# EasyEDA Pro project main_board_2025-10-18.epro

# Board PCB1
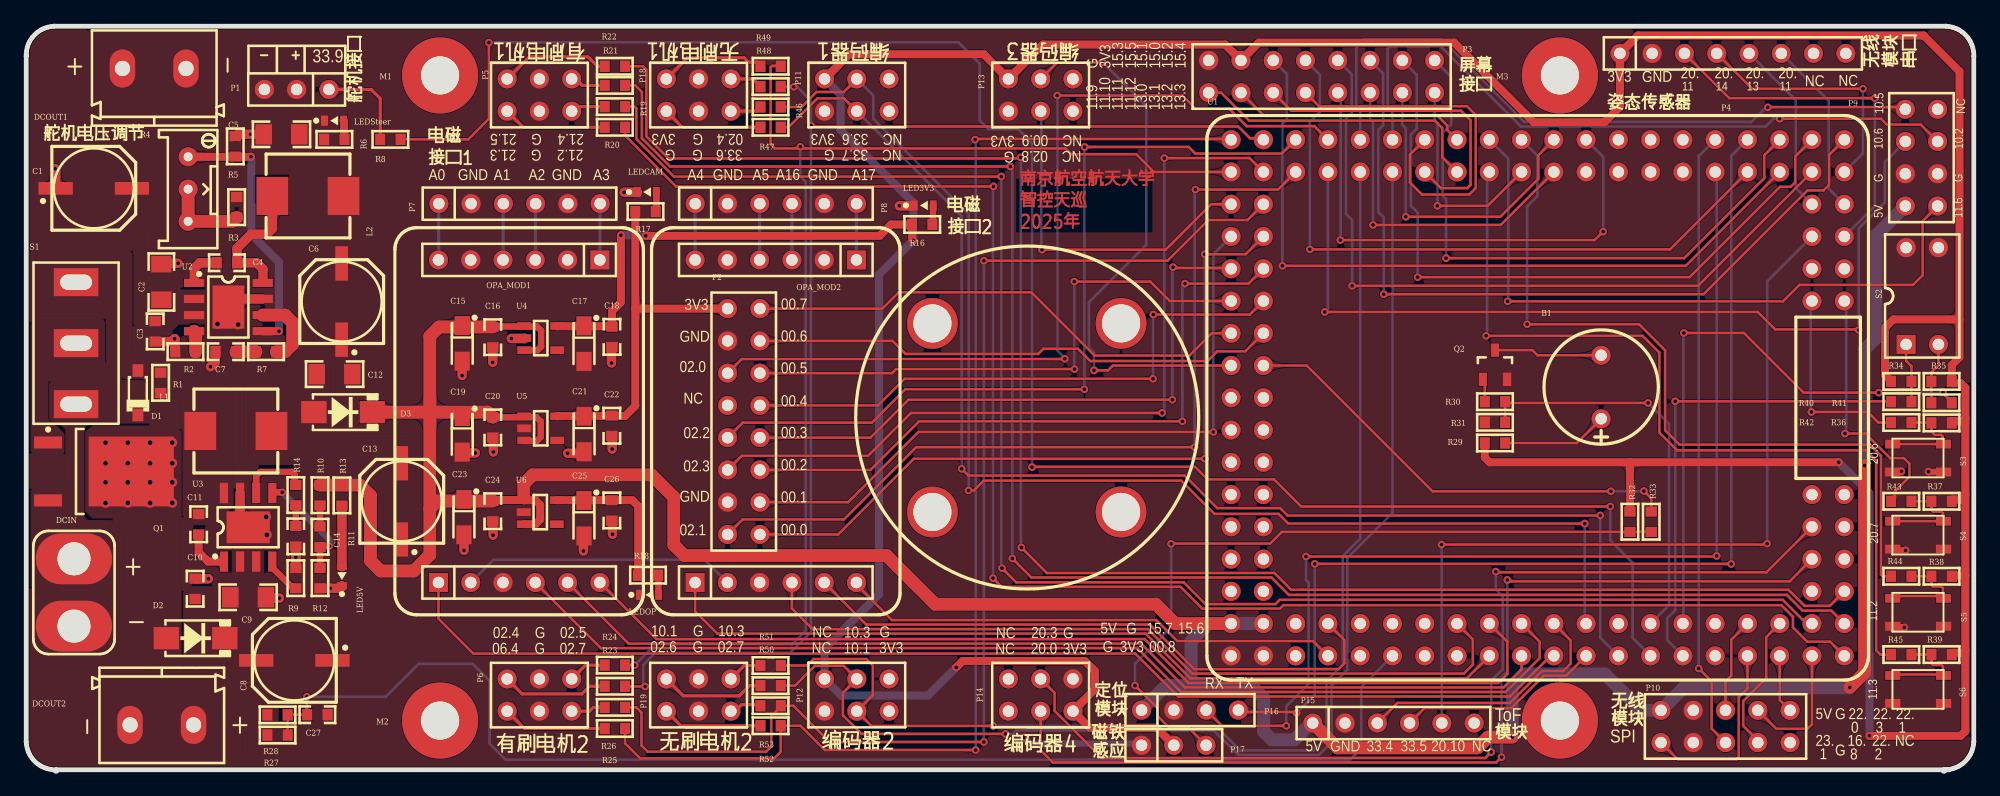
[diagram p0: board, top side]
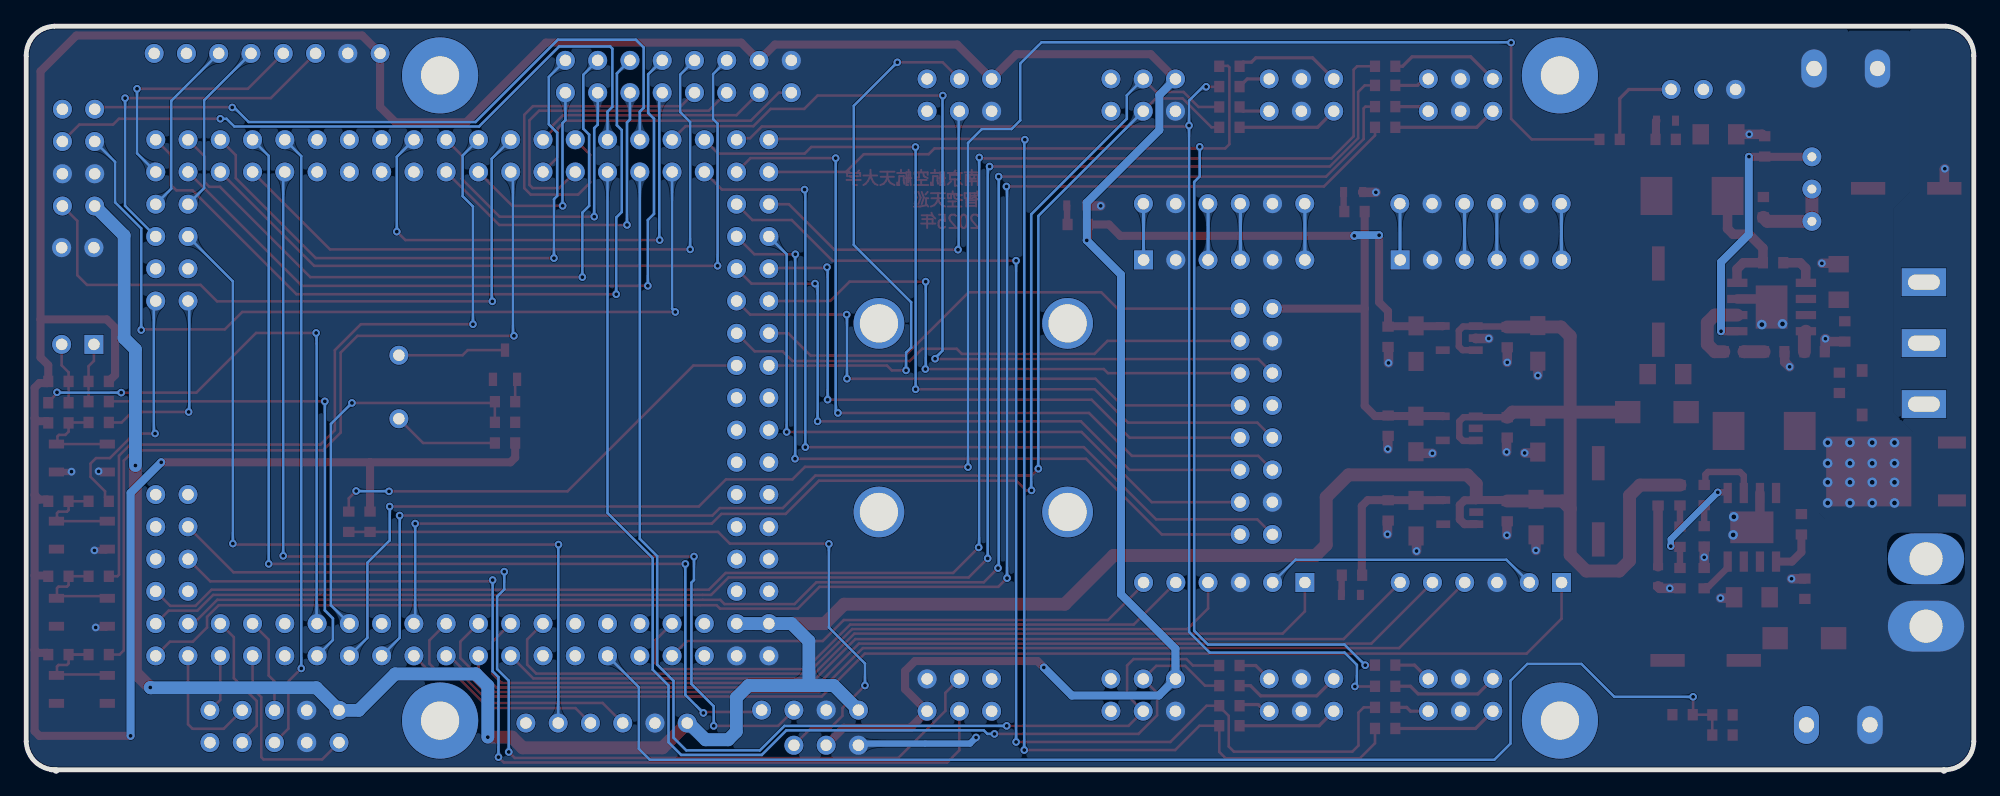
[diagram p1: board, bottom side, seen from below]

Outline 153.42 x 58.68 mm; copper layers: Top Layer, Bottom Layer. Coordinates in mm from the lower left corner of the outline.
Outline path: 0,56.26 0.13,56.26 arc(0.73,57.85) 2.29,58.55 151.13,58.55 arc(152.68,57.85) 153.29,56.26 153.29,2.29 arc(152.59,0.73) 151,0.13 ; 0,56.26 arc(0.64,57.94) 2.28,58.68 arc(2.28,58.68) 2.29,58.68 151.13,58.68 arc(151.13,58.68) 151.13,58.68 arc(152.75,57.96) 153.42,56.33 arc(153.42,56.29) 153.42,56.26 153.42,2.29 arc(153.42,2.29) 153.42,2.28 arc(152.84,0.81) 151.47,0.03 arc(151.43,0.01) 151.38,0 151.13,0 arc(151.07,0) 151,0 2.42,0 arc(0.73,0.64) 0,2.28 arc(0,2.3) 0,2.31 0,56.24 arc(0,56.25) 0,56.26 ; 0.13,56.39 0.13,2.29 arc(0.82,0.73) 2.41,0.13 151.38,0.13
Stack: Top Layer 0.0356mm / Dielectric 1 0.32mm FR-4 er 4.8 / Bottom Layer 0.0356mm

## Design rules (mm)
via RoutingVias (default): diameter min 0.61, default 1.27, max 1.27; hole min 0.305, default 0.711, max 0.711

## Placement (name value [footprint] x y rotation side)
B1  BEEP  [BEEP 9x5.5mm]  124.02 30.2 90 top
C1  100uF 35V 铝电解  [CAP-E-S 6.3]  5.38 45.85 180 top
C2  4.7uF 35V X5R  [CAPC3216[1206]S]  10.7 38.47 270 top
C3  100nF 50V X7R  [CAPC1608[0603]S-N]  10.22 34.58 90 top
C4  100nF 50V X7R  [CAPC1608[0603]S-N]  15.86 39.99 180 top
C5  47uF 25V X5R  [CAPC3216[1206]S]  20.16 50.1 0 top
C6  220uF 25V 铝电解  [CAP-E-S 6.3]  24.89 36.93 270 top
C7  4.7nF 50V X7R  [CAPC1608[0603]S-N]  15.77 32.98 0 top
C8  100uF 35V 铝电解  [CAP-E-S 6.3]  21.17 8.68 0 top
C9  4.7uF 35V X5R  [CAPC3216[1206]S]  17.53 13.65 180 top
C10  100nF 50V X7R  [CAPC1608[0603]S-N]  13.36 14.32 270 top
C11  100nF 50V X7R  [CAPC1608[0603]S-N]  13.63 19.39 270 top
C12  47uF 25V X5R  [CAPC3216[1206]S]  24.33 31.22 180 top
C13  220uF 25V 铝电解  [CAP-E-S 6.3]  29.62 21.2 270 top
C14  4.7nF 50V X7R  [CAPC1608[0603]S-N]  21.28 18.45 90 top
C15  10uF 16V 钽电容  [CAP-T-S 3216]  34.38 33.64 270 top
C16  100nF 50V X7R  [CAPC1608[0603]S-N]  36.79 34.13 90 top
C17  10uF 16V 钽电容  [CAP-T-S 3216]  43.96 33.62 270 top
C18  100nF 50V X7R  [CAPC1608[0603]S-N]  46.17 34.16 90 top
C19  10uF 16V 钽电容  [CAP-T-S 3216]  34.38 26.48 270 top
C20  100nF 50V X7R  [CAPC1608[0603]S-N]  36.79 27.02 90 top
C21  10uF 16V 钽电容  [CAP-T-S 3216]  43.97 26.51 270 top
C22  100nF 50V X7R  [CAPC1608[0603]S-N]  46.16 27.16 90 top
C23  10uF 16V 钽电容  [CAP-T-S 3216]  34.52 19.96 270 top
C24  100nF 50V X7R  [CAPC1608[0603]S-N]  36.79 20.43 90 top
C25  10uF 16V 钽电容  [CAP-T-S 3216]  43.96 19.87 270 top
C26  100nF 50V X7R  [CAPC1608[0603]S-N]  46.16 20.49 90 top
C27  100nF 50V X7R  [CAPC1608[0603]S-N]  22.98 4.4 0 top
D1  BZT52C16  [SOD-123-L]  8.85 29.75 270 top
D2  SS54  [SMA-L[DO-214AC]]  13.4 10.42 0 top
D3  SS54  [SMA-L[DO-214AC]]  25.01 28.23 0 top
DCIN  T型插头  [Wired T-Header ThroughHole]  3.82 14.02 0 top
DCOUT1  KF/WJ/DG 30x connecter  [KF/WJ/DG 301-2p-5.0mm]  10.14 55.28 180 top
DCOUT2  KF/WJ/DG 30x connecter  [KF/WJ/DG 301-2p-5.0mm]  10.73 3.6 0 top
L1  4.7uH 5A  [0630 TPC 7*7*3]  16.56 26.74 0 top
L2  4.7uH 5A  [0630 TPC 7*7*3]  22.24 45.25 0 top
LED3V3  翠绿贴片LED  [LEDC1608(0603)-L]  70.71 44.5 0 top
LED5V  翠绿贴片LED  [LEDC1608(0603)-L]  24.91 15.3 90 top
LEDCAM  翠绿贴片LED  [LEDC1608(0603)-L]  48.91 45.55 0 top
LEDOP  翠绿贴片LED  [LEDC1608(0603)-L]  49.09 13.84 0 top
LEDSteer  翠绿贴片LED  [LEDC1608(0603)-L]  24.29 51.17 0 top
M1  MountHole  [M3-MountHole-Plated-D6#3]  32.64 54.74 0 top
M2  MountHole  [M3-MountHole-Plated-D6#3]  32.64 3.94 0 top
M3  MountHole  [M3-MountHole-Plated-D6#3]  120.78 54.74 0 top
M4  MountHole  [M3-MountHole-Plated-D6#3]  120.78 3.94 0 top
M5  MountHole  [M3-MountHole-Plated-D6]  92.04 41.02 135 top
M6  MountHole  [M3-MountHole-Plated-D6#5]  92.7 24.3 135 top
M7  MountHole  [M3-MountHole-Plated-D6#2]  83.14 16.54 135 top
M8  MountHole  [M3-MountHole-Plated-D6#4]  77.88 13.87 135 top
OPA_MOD1  OPA_MOD  [SEEKFREE_4CHANEL_OPAMOD]  38.86 27.51 0 top
OPA_MOD2  OPA_MOD  [SEEKFREE_4CHANEL_OPAMOD]  59.06 27.51 0 top
P1  Header-D-M 1x3P  [HDR1X3-M]  23.89 53.63 180 top
P2  Header-D-F 2x8P  [HDR2X8-F]  57.81 18.59 90 top
P3  Header-D-F 2x8P  [HDR2X8-F]  93.14 53.38 0 top
P4  Header-D-M 1x8P  [HDR1X8-M]  125.5 56.47 0 top
P5  Header-D-M 2x3P  [HDR2X3-M]  43 54.46 180 top
P6  Header-D-M 2x3P  [HDR2X3-M]  37.92 4.68 0 top
P7  Header-D-M 1x6P  [HDR1X6-M]  32.54 44.64 0 top
P8  Header-D-M 1x6P  [HDR1X6-M]  52.72 44.64 0 top
P9  Header-D-F 2x4P  [HDR2X4-F]  147.97 52.07 270 top
P10  Header-D-F 2x5P  [HDR2X5-F]  138.9 4.75 180 top
P11  Header-D-M 2x3P  [HDR2X3-M]  67.98 54.46 180 top
P12  Header-D-M 2x3P  [HDR2X3-M]  67.98 7.22 180 top
P13  Header-D-M 2x3P  [HDR2X3-M]  82.45 54.46 180 top
P14  Header-D-M 2x3P  [HDR2X3-M]  77.37 4.68 0 top
P15  Header-D-M 1x6P  [HDR1X6-M]  101.33 3.74 0 top
P16  Header-D-M 1x4P  [HDR1X4-M]  87.85 4.76 0 top
P17  Header-D-M 1x3P  [HDR1X3-M]  87.85 2 0 top
P18  Header-D-M 2x3P  [HDR2X3-M]  55.52 54.46 180 top
P19  Header-D-M 2x3P  [HDR2X3-M]  50.44 4.68 0 top
Q1  HY19P03  [TO-252AA]  5.06 23.55 0 top
Q2  S8050  [SOT-23]  115.67 31.96 90 top
R1  10K ±1%  [RESC1608[0603]S-N]  10.64 30.53 90 top
R2  200K ±1%  [RESC1608[0603]S-N]  12.6 32.98 0 top
R3  27K ±1%  [RESC1608[0603]S-N]  16.63 44.36 90 top
R4  50K  [RESPOT3296W]  12.81 45.79 270 top
R5  8.2K ±1%  [RESC1608[0603]S-N]  16.52 49.15 270 top
R6  10K ±1%  [RESC1608[0603]S-N]  24.32 49.7 180 top
R7  20K ±1%  [RESC1608[0603]S-N]  18.94 32.98 0 top
R8  100R ±1%  [RESC1608[0603]S-N]  28.73 49.7 180 top
R9  200K ±1%  [RESC1608[0603]S-N]  21.28 15.15 270 top
R10  27K ±1%  [RESC1608[0603]S-N]  23.19 21.68 90 top
R11  1.5K ±1%  [RESC1608[0603]S-N]  23.19 18.42 90 top
R12  8.2K ±1%  [RESC1608[0603]S-N]  23.19 15.15 90 top
R13  10K ±1%  [RESC1608[0603]S-N]  24.91 21.67 90 top
R14  20K ±1%  [RESC1608[0603]S-N]  21.28 21.7 90 top
R16  2.7K ±1%  [RESC1608[0603]S-N]  70.59 43 0 top
R17  2.7K ±1%  [RESC1608[0603]S-N]  48.81 44.02 0 top
R18  2.7K ±1%  [RESC1608[0603]S-N]  49 15.39 0 top
R19  100R ±1%  [RESC1608[0603]S-N]  46.39 52.28 180 top
R20  100R ±1%  [RESC1608[0603]S-N]  46.39 50.65 0 top
R21  100R ±1%  [RESC1608[0603]S-N]  46.39 53.95 180 top
R22  100R ±1%  [RESC1608[0603]S-N]  46.39 55.46 0 top
R23  100R ±1%  [RESC1608[0603]S-N]  46.39 6.64 180 top
R24  100R ±1%  [RESC1608[0603]S-N]  46.39 8.31 0 top
R25  100R ±1%  [RESC1608[0603]S-N]  46.39 3.32 180 top
R26  100R ±1%  [RESC1608[0603]S-N]  46.39 4.98 0 top
R27  200K ±1%  [RESC1608[0603]S-N]  19.84 4.39 0 top
R28  20K ±1%  [RESC1608[0603]S-N]  19.84 2.8 180 top
R29  10R ±1%  [RESC1608[0603]S-N]  115.67 25.8 0 top
R30  4.7K ±1%  [RESC1608[0603]S-N]  115.67 29.05 180 top
R31  1K ±1%  [RESC1608[0603]S-N]  115.67 27.42 180 top
R32  10K ±1%  [RESC1608[0603]S-N]  126.29 19.59 90 top
R33  100R ±1%  [RESC1608[0603]S-N]  127.97 19.59 270 top
R34  4.7K ±1%  [RESC1608[0603]S-N]  147.65 30.64 0 top
R35  4.7K ±1%  [RESC1608[0603]S-N]  150.82 30.64 180 top
R36  4.7K ±1%  [RESC1608[0603]S-N]  150.82 27.38 180 top
R37  4.7K ±1%  [RESC1608[0603]S-N]  150.82 21.21 180 top
R38  4.7K ±1%  [RESC1608[0603]S-N]  150.82 15.3 180 top
R39  4.7K ±1%  [RESC1608[0603]S-N]  150.82 9.14 180 top
R40  470R ±1%  [RESC1608[0603]S-N]  147.65 29.05 180 top
R41  470R ±1%  [RESC1608[0603]S-N]  150.82 28.96 0 top
R42  470R ±1%  [RESC1608[0603]S-N]  147.65 27.41 180 top
R43  470R ±1%  [RESC1608[0603]S-N]  147.65 21.21 180 top
R44  470R ±1%  [RESC1608[0603]S-N]  147.65 15.3 180 top
R45  470R ±1%  [RESC1608[0603]S-N]  147.65 9.14 180 top
R46  100R ±1%  [RESC1608[0603]S-N]  58.65 52.25 180 top
R47  100R ±1%  [RESC1608[0603]S-N]  58.65 50.65 0 top
R48  100R ±1%  [RESC1608[0603]S-N]  58.65 53.86 180 top
R49  100R ±1%  [RESC1608[0603]S-N]  58.65 55.46 0 top
R50  100R ±1%  [RESC1608[0603]S-N]  58.65 6.69 180 top
R51  100R ±1%  [RESC1608[0603]S-N]  58.65 8.27 0 top
R52  100R ±1%  [RESC1608[0603]S-N]  58.65 3.53 180 top
R53  100R ±1%  [RESC1608[0603]S-N]  58.65 5.11 0 top
S1  SW-SPDT  [SS12D10]  3.99 33.66 90 top
S2  SW DIP-2  [Code SW-2-DIP-2.54]  149.3 37.37 0 top
S3  Button  [PTS810-3*4-CurvePin]  148.98 24.61 0 top
S4  Button  [PTS810-3*4-CurvePin]  148.98 18.54 0 top
S5  Button  [PTS810-3*4-CurvePin]  148.98 12.47 0 top
S6  Button  [PTS810-3*4-CurvePin]  148.98 6.39 0 top
U1  -  [TC264_CoreBoard]  94.9 9.03 90 top
U2  SP1N28STER  [SOP-8E]  15.98 36.5 0 top
U3  SP1N28STER  [SOP-8E]  17.53 19.16 90 top
U4  RT9013-33  [SOT-23-5]  40.56 34.06 0 top
U5  RT9013-33  [SOT-23-5]  40.56 26.95 0 top
U6  RT9013-33  [SOT-23-5]  40.52 20.35 0 top

## Footprints (pads in the part's own frame, mm; a bottom-side part is the same pattern mirrored in y, then rotated)
0630 TPC 7*7*3
  rect 2.5x3 smd: 1(-2.8,0) 2(2.8,0)
BEEP 9x5.5mm
  round 1.5 hole 0.9: 1(-2.5,0) 2(2.5,0)
CAP-E-S 6.3
  rect 2.7x1 smd: 1(-3,0) 2(3,0)
CAP-T-S 3216
  rect 1.5x1.2 smd: 1(-1.4,0) 2(1.4,0)
CAPC1608[0603]S-N
  rect 0.8x0.9 smd: 1(-0.8,0) 2(0.8,0)
CAPC3216[1206]S
  rect 1.3x1.6 smd: 1(-1.4,0) 2(1.4,0)
Code SW-2-DIP-2.54
  rect 1.5x1.5 hole 0.9: 1(-1.27,-3.81)
  round 1.5 hole 0.9: 2(1.27,-3.81) 3(1.27,3.81) 4(-1.27,3.81)
HDR1X3-M
  round 1.5 hole 0.9: 1(0,0) 2(2.54,0) 3(5.08,0)
HDR1X4-M
  round 1.5 hole 0.9: 1(0,0) 2(2.54,0) 3(5.08,0) 4(7.62,0)
HDR1X6-M
  round 1.5 hole 0.9: 1(0,0) 2(2.54,0) 3(5.08,0) 4(7.62,0) 5(10.16,0) 6(12.7,0)
HDR1X8-M
  round 1.5 hole 0.9: 1(0,0) 2(2.54,0) 3(5.08,0) 4(7.62,0) 5(10.16,0) 6(12.7,0) 7(15.24,0) 8(17.78,0)
HDR2X3-M
  round 1.5 hole 0.9: 1(0,0) 2(0,2.54) 3(2.54,0) 4(2.54,2.54) 5(5.08,0) 6(5.08,2.54)
HDR2X4-F
  round 1.5 hole 0.9: 1(0,0) 2(0,2.54) 3(2.54,0) 4(2.54,2.54) 5(5.08,0) 6(5.08,2.54) 7(7.62,0) 8(7.62,2.54)
HDR2X5-F
  round 1.5 hole 0.9: 1(0,0) 2(0,2.54) 3(2.54,0) 4(2.54,2.54) 5(5.08,0) 6(5.08,2.54) 7(7.62,0) 8(7.62,2.54) 9(10.16,0) 10(10.16,2.54)
HDR2X8-F
  round 1.5 hole 0.9: 1(0,0) 2(0,2.54) 3(2.54,0) 4(2.54,2.54) 5(5.08,0) 6(5.08,2.54) 7(7.62,0) 8(7.62,2.54) 9(10.16,0) 10(10.16,2.54) 11(12.7,0) 12(12.7,2.54) 13(15.24,0) 14(15.24,2.54) 15(17.78,0) 16(17.78,2.54)
KF/WJ/DG 301-2p-5.0mm
  oval 2x3 hole 1.2: 1(2.5,0) 2(-2.5,0)
LEDC1608(0603)-L
  rect 0.55x0.8 smd: A(0.75,0) C(-0.75,0)
M3-MountHole-Plated-D6
  round 4 hole 3: 1(0,8.21)
M3-MountHole-Plated-D6#2
  round 4 hole 3: 1(0.508,-4.896)
M3-MountHole-Plated-D6#3
  round 6 hole 3: 1(0,0)
M3-MountHole-Plated-D6#4
  round 4 hole 3: 1(9.182,0)
M3-MountHole-Plated-D6#5
  round 4 hole 3: 1(22.785,7.354)
PTS810-3*4-CurvePin
  rect 1.2x0.7 smd: 1(-2,-1.1) 1(2,-1.1) 2(-2,1.1) 2(2,1.1)
RESC1608[0603]S-N
  rect 0.8x0.9 smd: 1(-0.8,0) 2(0.8,0)
RESPOT3296W
  round 1.5 hole 0.7: 1(-2.54,0) 2(2.54,0) ADJ(0,0)
SEEKFREE_4CHANEL_OPAMOD
  rect 1.5x1.5 hole 0.9: 1(6.35,12.7) 7(-6.35,-12.7)
  round 1.5 hole 0.9: 2(3.81,12.7) 3(1.27,12.7) 4(-1.27,12.7) 5(-3.81,12.7) 6(-6.35,12.7) 8(-3.81,-12.7) 9(-1.27,-12.7) 10(1.27,-12.7) 11(3.81,-12.7) 12(6.35,-12.7)
SMA-L[DO-214AC]
  rect 2x1.75 smd: A(-2.3,0) K(2.3,0)
SOD-123-L
  rect 1x0.85 smd: A(-1.75,0) K(1.75,0)
SOP-8E
  rect 2.5x3.4 smd: 0(0,0)
  rect 1.6x0.65 smd: 1(-2.7,1.905) 2(-2.7,0.635) 3(-2.7,-0.635) 4(-2.7,-1.905) 5(2.7,-1.905) 6(2.7,-0.635) 7(2.7,0.635) 8(2.7,1.905)
SOT-23
  rect 1.05x0.65 smd: 1(-1.15,0.95) 2(-1.15,-0.95) 3(1.15,0)
SOT-23-5
  rect 1.1x0.6 smd: 1(-1.3,0.95) 2(-1.3,0) 3(-1.3,-0.95) 4(1.3,-0.95) 5(1.3,0.95)
SS12D10
  rect 2.2x3.5 hole 1.2x2.5: 1(-4.8,0) 2(0,0) 3(4.8,0)
TC264_CoreBoard
  round 1.5 hole 0.9: 1(0,0) 2(2.54,0) 3(0,-2.54) 4(2.54,-2.54) 5(0,-5.08) 6(2.54,-5.08) 7(0,-7.62) 8(2.54,-7.62) 9(0,-10.16) 10(2.54,-10.16) 11(0,-12.7) 12(2.54,-12.7) 13(0,-15.24) 14(2.54,-15.24) 15(0,-17.78) 16(2.54,-17.78) 17(0,-20.32) 18(2.54,-20.32) 19(0,-22.86) 20(2.54,-22.86) 21(0,-25.4) 22(2.54,-25.4) 23(0,-27.94) 24(2.54,-27.94) 25(0,-30.48) 26(2.54,-30.48) 27(0,-33.02) 28(2.54,-33.02) 29(0,-35.56) 30(2.54,-35.56) 31(0,-38.1) 32(2.54,-38.1) 33(0,-40.64) 34(2.54,-40.64) 35(0,-43.18) 36(2.54,-43.18) 37(0,-45.72) 38(2.54,-45.72) 39(0,-48.26) 40(2.54,-48.26) 41(5.08,-48.26) 42(5.08,-45.72) 43(7.62,-48.26) 44(7.62,-45.72) 45(10.16,-48.26) 46(10.16,-45.72) 47(12.7,-48.26) 48(12.7,-45.72) 49(27.94,-45.72) 50(27.94,-48.26) 51(30.48,-45.72) 52(30.48,-48.26) 53(33.02,-45.72) 54(33.02,-48.26) 55(35.56,-45.72) 56(35.56,-48.26) 57(38.1,-48.26) 58(40.64,-48.26) 59(38.1,-45.72) 60(40.64,-45.72) 61(38.1,-43.18) 62(40.64,-43.18) 63(38.1,-40.64) 64(40.64,-40.64) 65(38.1,-38.1) 66(40.64,-38.1) 67(38.1,-35.56) 68(40.64,-35.56) 69(38.1,-33.02) 70(40.64,-33.02) 71(38.1,-30.48) 72(40.64,-30.48) 73(38.1,-27.94) 74(40.64,-27.94) 75(38.1,-25.4) 76(40.64,-25.4) 77(38.1,-22.86) 78(40.64,-22.86) 79(38.1,-20.32) 80(40.64,-20.32) 81(38.1,-17.78) 82(40.64,-17.78) 83(38.1,-15.24) 84(40.64,-15.24) 85(38.1,-12.7) 86(40.64,-12.7) 87(38.1,-10.16) 88(40.64,-10.16) 89(38.1,-7.62) 90(40.64,-7.62) 91(38.1,-5.08) 92(40.64,-5.08) 93(38.1,-2.54) 94(40.64,-2.54) 95(38.1,0) 96(40.64,0) 97(35.56,-2.54) 98(35.56,0) 99(33.02,-2.54) 100(33.02,0) 101(30.48,-2.54) 102(30.48,0) 103(27.94,-2.54) 104(27.94,0) 105(25.4,-2.54) 106(25.4,0) 107(22.86,-2.54) 108(22.86,0) 109(20.32,-2.54) 110(20.32,0) 111(17.78,-2.54) 112(17.78,0) 113(15.24,-2.54) 114(15.24,0) 115(12.7,-2.54) 116(12.7,0) 117(10.16,-2.54) 118(10.16,0) 119(7.62,-2.54) 120(7.62,0) 121(5.08,-2.54) 122(5.08,0)
TO-252AA
  rect 6.7x5.5 smd: 1(3.275,0)
  rect 2.2x0.95 smd: 2(-3.275,2.28) 3(-3.275,-2.28)
Wired T-Header ThroughHole
  oval 6x4 hole 2.6: 1(0,2.65) 2(0,-2.65)

## Nets
GND: C1.2 C2.1 C3.1 C5.1 C6.2 C7.1 C8.2 C9.1 C10.1 C12.1 C13.2 C14.1 C15.2 C16.1 C17.2 C18.1 C19.2 C20.1 C21.2 C22.1 C23.2 C24.1 C25.2 C26.1 C27.2 DCIN.2 DCOUT1.2 DCOUT2.2 LED3V3.C LED5V.C LEDCAM.C LEDOP.C LEDSteer.C OPA_MOD1.2 OPA_MOD1.5 OPA_MOD1.9 OPA_MOD2.2 OPA_MOD2.5 OPA_MOD2.9 P1.3 P2.4 P2.14 P3.2 P4.2 P5.3 P5.4 P6.3 P6.4 P7.2 P7.5 P8.2 P8.5 P9.5 P9.6 P10.7 P10.8 P11.6 P12.6 P13.6 P14.6 P15.2 P16.2 P17.1 P18.3 P18.4 P19.3 P19.4 Q2.2 R1.1 R2.1 R5.1 R9.1 R12.1 R28.2 R31.2 S2.3 S2.4 S3.1 S4.1 S5.1 S6.1 U1.1 U1.3 U2.0 U2.7 U3.0 U3.7 U4.2 U5.2 U6.2
VCC3V3: C17.1 C18.2 P3.4 P4.1 P11.5 P12.5 P13.5 P14.5 P17.2 R16.1 R29.1 R32.2 R34.1 R35.1 R36.1 R37.1 R38.1 R39.1 U4.5
VCC5V: C15.1 C16.2 C19.1 C20.2 C23.1 C24.2 D3.K P9.7 P10.9 P15.1 P16.1 R10.2 R13.2 U1.2 U1.4 U4.1 U4.3 U5.1 U5.3 U6.1 U6.3
VCCBAT: C1.1 C2.2 C3.2 D2.A DCOUT1.1 DCOUT2.1 Q1.1 R27.1 U2.2 U2.3
VCCCAM: C21.1 C22.2 P2.16 R17.1 U5.5
VCCCOP: C25.1 C26.2 R18.1 U6.5
VCCOP: OPA_MOD1.8 OPA_MOD2.8
VCCSTEER: C5.2 C6.1 L2.2 P1.2 R3.2 R6.2
00.0: P2.1 U1.99
00.1: P2.3 U1.100
00.2: P2.5 U1.101
00.3: P2.7 U1.102
00.4: P2.9 U1.103
00.5: P2.11 U1.104
00.6: P2.13 U1.105
00.7: P2.15 U1.106
00.8: R33.1 U1.107
00.9: P13.3 U1.108
02.0: P2.12 U1.90
02.1: P2.2 U1.91
02.2: P2.8 U1.92
02.3: P2.6 U1.93
02.4: R23.1 R48.1 U1.94
02.5: R24.2 R49.2 U1.95
02.6: R25.1 R52.1 U1.96
02.7: R26.2 R53.2 U1.97
02.8: P13.4 U1.98
10.1: P12.3 R50.1 U1.85
10.2: P9.4 U1.86
10.3: P12.4 R51.2 U1.87
10.5: P9.1 U1.88
10.6: P9.3 U1.89
11.2: R44.2 U1.78
11.3: R45.2 U1.79
11.6: P9.8 U1.80
11.9: P3.1 U1.81
11.10: P3.3 U1.82
11.11: P3.5 U1.83
11.12: P3.7 U1.84
13.0: P3.9 U1.74
13.1: P3.11 U1.75
13.2: P3.13 U1.76
13.3: P3.15 U1.77
15.0: P3.12 U1.58
15.1: P3.10 U1.59
15.2: P3.14 U1.60
15.3: P3.6 U1.61
15.4: P3.16 U1.62
15.5: P3.8 U1.63
15.6: P16.4 U1.64
15.7: P16.3 U1.65
15.8: P10.6 U1.66
20.0: P14.3 U1.44
20.3: P14.4 U1.46
20.6: R42.2 U1.49
20.7: R43.2 U1.50
20.10: P15.5 U1.53
20.11: P4.3 U1.54
20.12: P4.5 U1.55
20.13: P4.6 U1.56
20.14: P4.4 U1.57
21.2: R19.1 U1.38
21.3: R20.2 U1.39
21.4: R21.1 U1.40
21.5: R22.2 U1.41
22.0: P10.5 U1.34
22.1: P10.1 U1.35
22.2: P10.4 U1.36
22.3: P10.3 U1.37
23.1: P10.10 U1.33
33.4: P15.3 U1.22
33.5: P15.4 U1.23
33.6: P11.3 R46.1 U1.24
33.7: P11.4 R47.2 U1.25
33.9: R8.1 U1.27
33.10: R30.1 R31.1 U1.28
33.11: R40.2 U1.29
33.12: R41.2 U1.30
A0: OPA_MOD1.7 U1.21
A1: OPA_MOD1.10 U1.20
A2: OPA_MOD1.11 U1.19
A3: OPA_MOD1.12 U1.18
A4: OPA_MOD2.7 U1.17
A5: OPA_MOD2.10 U1.16
A11: C27.1 R27.2 R28.1 U1.11
A16: OPA_MOD2.11 U1.8
A17: OPA_MOD2.12 U1.7
NETB1_1: B1.1 R29.2
NETB1_2: B1.2 Q2.3
NETC4_1: C4.1 L2.1 U2.8
NETC4_2: C4.2 U2.1
NETC7_2: C7.2 R7.1
NETC8_1: C8.1 C9.2 C10.2 D2.K U3.2 U3.3
NETC11_1: C11.1 L1.1 U3.8
NETC11_2: C11.2 U3.1
NETC12_2: C12.2 C13.1 D3.A L1.2
NETC14_2: C14.2 R14.1
NETD1_A: D1.A R1.2 S1.3
NETD1_K: D1.K DCIN.1 Q1.3 S1.1
NETLED3V3_A: LED3V3.A R16.2
NETLED5V_A: LED5V.A R13.1
NETLEDCAM_A: LEDCAM.A R17.2
NETLEDOP_A: LEDOP.A R18.2
NETLEDSTEER_A: LEDSteer.A R6.1
NETOPA_MOD1_1: OPA_MOD1.1 P7.6
NETOPA_MOD1_3: OPA_MOD1.3 P7.4
NETOPA_MOD1_4: OPA_MOD1.4 P7.3
NETOPA_MOD1_6: OPA_MOD1.6 P7.1
NETOPA_MOD2_1: OPA_MOD2.1 P8.6
NETOPA_MOD2_3: OPA_MOD2.3 P8.4
NETOPA_MOD2_4: OPA_MOD2.4 P8.3
NETOPA_MOD2_6: OPA_MOD2.6 P8.1
NETP1_1: P1.1 R8.2
NETP5_1: P5.1 R21.2
NETP5_2: P5.2 R19.2
NETP5_5: P5.5 R22.1
NETP5_6: P5.6 R20.1
NETP6_1: P6.1 R25.2
NETP6_2: P6.2 R23.2
NETP6_5: P6.5 R26.1
NETP6_6: P6.6 R24.1
NETP17_3: P17.3 R32.1 R33.2
NETP18_1: P18.1 R48.2
NETP18_2: P18.2 R46.2
NETP18_5: P18.5 R49.1
NETP18_6: P18.6 R47.1
NETP19_1: P19.1 R52.2
NETP19_2: P19.2 R50.2
NETP19_5: P19.5 R53.1
NETP19_6: P19.6 R51.1
NETQ1_2: Q1.2 S1.2
NETQ2_1: Q2.1 R30.2
NETR2_2: R2.2 U2.4
NETR3_1: R3.1 R4.2 R4.ADJ
NETR4_1: R4.1 R5.2 U2.5
NETR7_2: R7.2 U2.6
NETR9_2: R9.2 U3.4
NETR10_1: R10.1 R11.2
NETR11_1: R11.1 R12.2 U3.5
NETR14_2: R14.2 U3.6
NETR34_2: R34.2 R40.1 S2.1
NETR35_2: R35.2 R41.1 S2.2
NETR36_2: R36.2 R42.1 S3.2
NETR37_2: R37.2 R43.1 S4.2
NETR38_2: R38.2 R44.1 S5.2
NETR39_2: R39.2 R45.1 S6.2

Pads without a net: M1 1; M2 1; M3 1; M4 1; M5 1; M6 1; M7 1; M8 1; P2 10; P4 7 8; P9 2; P10 2; P11 1 2; P12 1 2; P13 1 2; P14 1 2; P15 6; U1 5 6 9 10 12 13 14 15 26 31 32 42 43 45 47 48 51 52 67 68 69 70 71 72 73 109 110 111 112 113 114 115 116 117 118 119 120 121 122; U4 4; U5 4; U6 4

## Via types
v1: diameter 0.61, hole 0.305, Top Layer to Bottom Layer, 134 vias
v2: diameter 0.762, hole 0.381, Top Layer to Bottom Layer, 20 vias

## Routing (per net, layer and track width the routed paths; a pad name or vN(x,y) marks a point on that pad's centre or on a via; arc(x,y) is an arc through that point)
GND: length 48.9
  Top Layer w0.5: v1(147.88,11.27) 147.07,11.27 S5.1 ; S3.1 149.82,23.51 v1(149.79,23.54) ; v1(147.99,17.34) 147.07,17.34 146.98,17.44 ; v1(147.66,23.56) 147.03,23.56 S3.1
  Top Layer w0.75: v1(35.41,25.01) 34.39,25.01 34.37,24.99 ; LED5V.C 24.91,14.48 24.79,14.35 v1(23.99,14.35) R12.1 ; C10.1 13.37,15.11 v1(14.41,15.11) ; 34.35,32.15 34.37,32.13 v1(34.37,31.11) ; U2.0 16.61,37.14 U2.7 ; 36.77,33.18 36.78,33.17 v1(36.78,32.14) ; R5.1 16.57,49.95 16.72,50.1 v1(17.74,50.1) C5.1 ; R2.1 11.77,33.01 11.77,33.97 v1(11.74,34) 11.52,33.78 C3.1 ; v1(20,13.58) 19,13.58 C9.1 ; U3.7 16.9,19.79 U3.0 ; 36.82,26.13 36.84,26.11 v1(36.84,25.09) ; v1(2.34,47.39) 2.38,47.35 C1.2 ; v1(36.81,18.53) 36.81,19.56 36.79,19.58 ; C2.1 10.77,39.95 v1(12.02,39.95) ; 46.16,26.36 46.18,26.34 v1(46.18,25.32) ; v1(46.13,32.1) 46.13,33.12 ; v1(46.21,18.61) 46.21,19.63 46.19,19.65 ; v1(38.24,34.02) 39.26,34.02 39.28,34.04 ; v1(47.12,45.53) 48.15,45.53 LEDCAM.C ; 43.9,18.33 43.92,18.31 v1(43.92,17.29) ; C7.1 14.95,32.96 14.95,32.18 v1(14.56,31.79) ; 43.72,25 43.7,24.99 v1(42.68,24.99) ; 34.51,18.38 34.52,18.36 v1(34.52,17.34) ; 69.82,44.48 69.81,44.47 v1(68.78,44.47) ; C14.1 v1(21.28,16.8) R9.1
  Bottom Layer w0.5: v1(78.59,2.61) 79.07,2.13 87.68,2.13 87.7,2.15 P17.1
  vias: v2(15.12,35.17) v2(16.74,35.12) v2(18.95,19.98) v2(19.01,18.56)
VCC3V3: length 359.7
  Top Layer w0.635: U4.5 41.88,34.99 46.14,34.99 C18.2 46.17,36.17 46.87,36.87 v1(46.87,42.16) ; P17.2 89.02,3.37 83.76,3.37 P14.5 84.18,6.41 84.18,7.84 83.39,8.63 73.77,8.63 v1(73.26,8.12) ; R36.1 151.62,27.43 151.7,27.51 152.45,27.51 152.69,27.75 ; R29.1 114.87,24.65 115.24,24.27 126.29,24.27 ; P11.5 64.84,56.41 75.42,56.41 P13.5 80.08,57.17 94.43,57.17 P3.4 97.08,57.32 112.45,57.32 118.73,51.05 124.29,51.05 125.5,52.26 P4.1 126.91,57.88 149.41,57.88 152.23,55.06 152.23,35.53 ; R32.2 126.29,24.27 ; 126.29,24.27 v1(142.73,24.27) ; 152.23,35.53 147.02,35.53 146.36,34.87 146.36,31.15 146.73,30.78 146.77,30.78 146.85,30.69 R34.1 ; 152.23,35.53 152.23,32.53 151.62,31.92 R35.1 151.62,30.69 ; 152.69,15.36 151.68,15.36 R38.1 ; 152.69,15.36 152.69,9.51 ; 152.69,15.36 152.69,21.71 ; v1(145.14,2.74) 152.32,2.74 152.69,3.11 152.69,9.51 ; R37.1 151.62,21.26 151.7,21.34 152.32,21.34 152.69,21.71 ; R39.1 151.62,9.19 151.7,9.27 152.45,9.27 152.69,9.51 ; 152.69,27.75 152.69,30.14 152.32,30.51 151.7,30.51 151.62,30.59 ; 152.69,27.75 152.69,21.71 ; v1(48.82,42.11) 67.24,42.11 68.14,43 R16.1 69.79,41.84 v1(69.88,41.75)
  Bottom Layer w0.635: v1(73.26,8.12) 71.05,5.91 64.21,5.91 P12.5 62.9,9.59 67.19,13.89 67.19,39.06 v1(69.88,41.75) 69.88,44.72 64.17,50.44 64.17,53.19 P11.5 ; v1(48.82,42.11) 48.77,42.16 v1(46.87,42.16) ; v1(145.14,2.74) 145.14,21.86 v1(142.73,24.27)
VCC5V: length 254.2
  Top Layer w0.508: U4.3 40.3,33.11 40.6,33.4 40.6,34.64 40.27,34.97 36.83,34.97 C16.2 ; C20.2 40.23,27.82 40.56,27.49 40.56,26.26 40.26,25.96 39.23,25.96
  Top Layer w0.635: U6.3 40.15,19.4 40.52,19.77 40.52,20.91 40.15,21.29 39.24,21.29 U6.1 36.05,21.3 36.04,21.29
  Top Layer w1.016: 39.22,21.63 39.22,22.57 39.93,23.28 49.28,23.28 51.03,21.53 51.03,17.77 51.87,16.93 67.78,16.93 71.61,13.1 88.98,13.1 90.51,11.57 U1.2 ; C20.2 36.39,28.23 31.83,28.23 ; v1(143.59,6.55) 144.76,7.71 v1(144.76,24.02) ; 31.83,20.62 31.83,28.23 ; 31.83,20.62 32.44,21.23 C24.2 ; 31.83,20.62 31.83,16.98 30.56,15.71 27.97,15.71 27.16,16.53 27.16,21.66 26.34,22.48 R10.2 ; 31.83,28.23 31.83,34.21 32.56,34.93 C16.2 ; 31.83,28.23 D3.K ; v1(117.02,2.63) 115.12,2.63 114.28,1.8 103.27,1.8 P15.1
  Bottom Layer w1.016: 91.75,6.7 91.75,10.2 93.12,11.57 U1.2 97.39,11.57 97.42,11.55 U1.4 ; 91.75,6.7 96.5,6.7 97.47,5.73 97.47,3.07 98.1,2.43 99.88,2.43 101.19,3.74 P15.1 ; 91.75,6.7 89.79,6.7 P16.1 ; P9.7 145.65,42.14 145.65,34.05 144.76,33.16 v1(144.76,24.02) ; v1(143.59,6.55) 143.57,6.52 130.51,6.52 P10.9 127.18,4.75 124.31,7.61 117.96,7.61 117.02,6.67 v1(117.02,2.63)
VCCBAT:
  vias: v2(6.31,25.82) v2(6.31,24.2) v2(6.31,22.7) v2(6.31,21.07) v2(8.06,25.82) v2(8.06,24.2) v2(8.06,22.7) v2(8.06,21.07) v2(9.81,25.82) v2(9.81,24.2) v2(9.81,22.7) v2(9.81,21.07) v2(11.56,25.82) v2(11.56,24.2) v2(11.56,22.7) v2(11.56,21.07)
VCCCAM: length 29
  Top Layer w0.635: 48.01,36.37 R17.1 ; 48.01,36.37 P2.16 ; 48.01,36.37 48.01,28.72 47.2,27.92 41.88,27.92 U5.5
VCCCOP: length 12
  Top Layer w0.635: U6.5 41.83,21.29 47.77,21.29 48.23,20.83 48.23,15.39
VCCOP: length 21.7
  Bottom Layer w0.203: OPA_MOD2.8 53.46,16.6 36.85,16.6 OPA_MOD1.8
00.0: length 58.8
  Top Layer w0.203: v1(92.82,40.66) 96.04,40.66 U1.99 ; v1(92.84,24.55) 69.93,24.55 63.97,18.59 P2.1
  Bottom Layer w0.203: v1(92.82,40.66) 92.83,40.64 92.83,24.59 92.82,24.58 v1(92.84,24.55)
00.1: length 54
  Top Layer w0.203: P2.3 64.76,21.13 70.29,26.66 v1(93.5,26.66)
  Bottom Layer w0.203: v1(93.5,26.66) 93.5,40.66 U1.100
00.2: length 52.4
  Top Layer w0.203: v1(91.27,38.35) 96.27,38.35 U1.101 ; P2.5 66.51,23.67 70.34,27.5 v1(91.06,27.5)
  Bottom Layer w0.203: v1(91.27,38.35) 91.06,38.14 v1(91.06,27.5)
00.3: length 48.8
  Top Layer w0.203: v1(90.33,39.64) 90.39,39.58 94.71,39.58 94.77,39.64 U1.102 ; P2.7 66.51,26.21 69.5,29.2 v1(90.28,29.2)
  Bottom Layer w0.203: v1(90.33,39.64) 90.28,39.59 v1(90.28,29.2)
00.4: length 46
  Top Layer w0.203: v1(88.75,30.85) 69.2,30.85 67.1,28.75 P2.9 ; v1(88.78,35.91) 96.37,35.91 U1.103
  Bottom Layer w0.203: v1(88.78,35.91) 88.75,35.88 v1(88.75,30.85)
00.5: length 44.8
  Top Layer w0.203: U1.104 90.07,36.97 88.55,38.5 v1(82.56,38.5) ; v1(82.58,31.62) 68.53,31.62 68.21,31.29 P2.11
  Bottom Layer w0.203: v1(82.58,31.62) 82.56,31.64 v1(82.56,38.5)
00.6: length 41.5
  Top Layer w0.203: P2.13 68.25,33.83 69.27,32.81 79.71,32.81 80.12,33.22 82.84,33.22 83.8,32.25 93.05,32.25 93.81,33.01 96.02,33.01 U1.105
00.7: length 40.4
  Top Layer w0.203: U1.106 93.38,34.43 91.62,32.68 84.16,32.68 79.18,37.66 68.74,37.66 67.45,36.37 P2.15
00.8: length 35.9
  Top Layer w0.203: v1(124.8,21.99) 110.75,21.99 100.84,31.89 U1.107 ; v1(127.39,22.01) 127.97,21.43 R33.1
  Bottom Layer w0.203: v1(124.8,21.99) 124.82,22.01 124.83,22 127.37,22 v1(127.39,22.01)
00.9: length 44.1
  Top Layer w0.203: U1.108 85.6,31.89 85.22,31.51 v1(84.11,31.51) ; P13.3 81.22,55.77 v1(84.79,55.77)
  Bottom Layer w0.203: v1(84.11,31.51) 84.11,32.91 83.71,33.31 83.71,36.88 88.22,41.39 88.22,52.34 v1(84.79,55.77)
02.0: length 70.7
  Top Layer w0.203: v1(81.82,32.43) 81.79,32.4 56.38,32.4 P2.12 ; v1(81.21,53.15) 91.06,53.15 92.12,52.1 94.76,52.1 96.12,50.74 101.45,50.74 U1.90
  Bottom Layer w0.203: v1(81.21,53.15) 81.24,53.13 81.24,33.06 81.82,32.48 v1(81.82,32.43)
02.1: length 68.4
  Top Layer w0.203: U1.91 98.6,45.75 v1(92.09,45.75) ; v1(92.03,25.47) 70.11,25.47 64.42,19.78 56.46,19.78 P2.2
  Bottom Layer w0.203: v1(92.09,45.75) 92.03,45.69 v1(92.03,25.47)
02.2: length 66
  Top Layer w0.203: U1.92 98.89,48.58 92.08,48.58 91.56,49.1 v1(83.36,49.1) ; P2.8 56.46,27.4 66.63,27.4 69.26,30.03 v1(83.35,30.03)
  Bottom Layer w0.203: v1(83.36,49.1) 83.35,49.09 v1(83.35,30.03)
02.3: length 64.4
  Top Layer w0.203: U1.93 96.35,48.23 v1(89.64,48.23) ; P2.6 56.38,24.78 66.33,24.78 69.7,28.16 v1(89.46,28.16)
  Bottom Layer w0.203: v1(89.64,48.23) 89.64,28.34 v1(89.46,28.16)
02.4: length 98.4
  Top Layer w0.203: R23.1 47.21,6.62 v1(48.77,6.62) ; R48.1 59.47,53.84 v1(60.48,53.84) ; U1.94 97.33,49.79 96.39,49.79 95.46,50.72 61.91,50.72 v1(61.83,50.79)
  Bottom Layer w0.203: v1(60.48,53.84) 60.74,53.84 61.83,52.75 v1(61.83,50.79) 61.83,10.91 60.2,9.29 49.59,9.29 48.62,8.32 48.62,6.77 v1(48.77,6.62)
02.5: length 97.7
  Top Layer w0.203: R24.2 47.95,8.31 v1(47.96,8.3) ; 59.42,55.49 58.77,55.49 58.65,55.37 58.65,49.32 58.98,48.99 81.87,48.99 82.33,48.53 87.43,48.53 88.83,47.13 U1.95
  Bottom Layer w0.203: v1(47.96,8.3) 49.59,9.92 60.34,9.92 61.42,11.01 61.42,46.35 60.99,46.78 v1(60.99,49.12)
02.6: length 100.7
  Top Layer w0.203: v1(74.8,1.62) 62.92,1.62 61.01,3.53 R52.1 59.45,1.48 58.93,0.96 48.39,0.96 47.19,2.16 R25.1 ; v1(74.75,49.68) 74.81,49.74 94.71,49.74 94.77,49.8 U1.96
  Bottom Layer w0.203: v1(74.75,49.68) 74.8,49.63 v1(74.8,1.62)
02.7: length 97.1
  Top Layer w0.203: v1(75.44,2.25) 63.3,2.25 60.45,5.11 R53.2 59.45,5.06 58.71,4.31 58.71,1.9 58.3,1.49 48.98,1.49 48.49,1.97 48.49,4.56 48.08,4.98 R26.2 ; U1.97 96.2,43.35 93.1,43.35 89.9,40.15 v1(75.44,40.15)
  Bottom Layer w0.203: v1(75.44,2.25) v1(75.44,40.15)
02.8: length 27.3
  Top Layer w0.203: U1.98 93.33,44.59 89.74,41.01 v1(80.02,41.01)
  Bottom Layer w0.203: P13.4 79.96,51.87 79.96,41.07 v1(80.02,41.01)
10.1: length 97.7
  Top Layer w0.203: R50.1 60.58,6.69 62.13,8.25 64.41,8.25 P12.3 64.34,6.13 64.34,4.35 65.81,2.89 v1(77.15,2.89)
  Bottom Layer w0.203: U1.85 107.6,20.29 104.04,16.73 104.04,7.94 102.8,6.7 102.8,2.23 101.81,1.24 95.46,1.24 93.53,3.17 77.98,3.17 77.7,2.89 v1(77.15,2.89)
10.2: length 54.3
  Top Layer w0.203: v1(138.08,51.33) 146.06,51.33 146.51,50.87 149.17,50.87 P9.4
  Bottom Layer w0.203: v1(138.08,51.33) 137.58,51.33 136.97,50.72 117.71,50.72 111.41,57.02 107.4,57.02 107.22,56.84 107.22,52.27 107.6,51.88 U1.86
10.3: length 96.1
  Top Layer w0.203: R51.2 61.53,8.27 62.03,8.78 66.2,8.78 66.71,8.27 66.71,5.95 P12.4 66.59,3.52 v1(76.18,3.52)
  Bottom Layer w0.203: U1.87 105.06,18.25 103.69,16.88 103.69,8.35 102.41,7.07 102.41,2.6 101.4,1.59 95.61,1.59 93.68,3.52 v1(76.18,3.52)
10.5: length 54.1
  Top Layer w0.203: v1(137.14,52.21) 137.17,52.24 147.8,52.24 P9.1
  Bottom Layer w0.203: v1(137.14,52.21) 136.99,52.21 135.84,51.07 117.99,51.07 111.51,57.55 105.37,57.55 104.76,56.94 104.76,52.19 105.06,51.88 U1.88
10.6: length 70.1
  Top Layer w0.203: v1(102.27,36.11) 136.35,36.11 137.72,34.74 144.25,34.74 v1(144.3,34.69)
  Bottom Layer w0.203: v1(144.3,34.69) 144.3,42.69 146.36,44.75 146.36,47.93 P9.3 ; U1.89 102.52,36.37 v1(102.27,36.11)
11.2: length 61.4
  Top Layer w0.203: v1(118.19,35.15) 127.02,35.15 129.06,33.1 129.06,26.8 130.19,25.67 145.17,25.67 146.05,24.79 146.05,15.42 146.17,15.3 R44.2
  Bottom Layer w0.203: v1(118.19,35.15) 118.19,44.42 119,45.23 119,48.43 U1.78
11.3: length 67.7
  Top Layer w0.203: R45.2 146.01,9.14 145.68,9.47 145.68,24.4 144.86,25.21 130,25.21 128.61,26.61 128.61,32.91 127.28,34.23 v1(114.97,34.23)
  Bottom Layer w0.203: U1.79 115.04,46.96 115.04,34.31 v1(114.97,34.23)
11.6: length 52.8
  Top Layer w0.203: P9.8 149.33,43.28 149.33,39.01 148.57,38.24 139.63,38.24 138.33,36.95 v1(116.67,36.95)
  Bottom Layer w0.203: U1.80 116.72,48.18 116.72,37 v1(116.67,36.95)
11.9: length 23.5
  Top Layer w0.203: U1.81 111.51,48.3 111.51,50.59 110.93,51.17 96.32,51.17 94.12,53.38 P3.1
11.10: length 18.7
  Top Layer w0.203: U1.82 111.91,50.45 111.91,50.8 111.11,51.61 97.45,51.61 P3.3
11.11: length 25.8
  Top Layer w0.203: U1.83 111.41,45.86 113.49,45.86 113.75,46.12 113.75,51.2 112.99,51.96 99.63,51.96 P3.5
11.12: length 29.5
  Top Layer w0.203: U1.84 108.97,48.51 108.97,46.3 109.91,45.36 113.65,45.36 114.15,45.86 114.15,51.63 113.47,52.32 101.82,52.32 P3.7
13.0: length 40.5
  Top Layer w0.203: v1(103.5,41.77) 123.51,41.77 124.18,42.44 v1(124.19,42.44)
  Bottom Layer w0.203: U1.74 124.19,48.33 v1(124.19,42.44) ; v1(103.5,41.77) 103.52,41.8 103.52,53.13 103.54,53.14 P3.9
13.1: length 26.5
  Top Layer w0.203: U1.75 116.13,42.96 v1(106.07,42.96)
  Bottom Layer w0.203: P3.11 105.84,51.26 106.07,51.03 v1(106.07,42.96)
13.2: length 25.1
  Top Layer w0.203: v1(108.65,43.61) 116.09,43.61 119.08,46.6 119.08,48.46 U1.76
  Bottom Layer w0.203: P3.13 108.38,50.86 108.65,50.58 v1(108.65,43.61)
13.3: length 16.7
  Top Layer w0.203: v1(111.13,44.47) 115.09,44.47 U1.77
  Bottom Layer w0.203: v1(111.13,44.47) 111.14,44.48 111.14,50.98 110.92,51.21 P3.15
15.0: length 61.8
  Top Layer w0.203: U1.58 141.97,48.48 141.97,46.12 141.53,45.69 140.26,45.69 132.09,37.51 v1(106.91,37.51)
  Bottom Layer w0.203: P3.12 106.86,54.89 106.86,50.82 106.48,50.44 106.48,43.99 106.91,43.55 v1(106.91,37.51)
15.1: length 58.5
  Top Layer w0.203: U1.59 131.65,38.17 v1(104.43,38.17)
  Bottom Layer w0.203: P3.10 104.4,54.82 104.4,51.78 103.94,51.33 103.94,43.83 104.43,43.35 v1(104.43,38.17)
15.2: length 54.7
  Top Layer w0.203: U1.60 139.3,48.35 139.3,46.32 138.94,45.97 138.11,45.97 130.99,38.85 v1(109.58,38.85)
  Bottom Layer w0.203: P3.14 109.5,54.79 109.5,50.54 109.05,50.08 109.05,44.47 109.58,43.93 v1(109.58,38.85)
15.3: length 59
  Top Layer w0.203: v1(98.94,39.74) 130.69,39.74 U1.61
  Bottom Layer w0.203: P3.6 99.29,54.84 99.29,51.3 98.94,50.94 v1(98.94,39.74)
15.4: length 47.7
  Top Layer w0.203: U1.62 136.86,48.46 136.86,46.65 130.56,40.35 v1(111.82,40.35)
  Bottom Layer w0.203: v1(111.82,40.35) 111.82,45 111.56,45.25 111.56,50.23 112.22,50.89 112.22,54.61 P3.16
15.5: length 52.6
  Top Layer w0.203: v1(101.1,41.04) 129.44,41.04 U1.63
  Bottom Layer w0.203: P3.8 101.89,54.79 101.89,51.86 101.1,51.07 v1(101.1,41.04)
15.6: length 83.7
  Top Layer w0.203: v1(101.48,16.27) v1(134.27,16.27) ; v1(100.06,4.54) 99.98,4.62 95.62,4.62 P16.4
  Bottom Layer w0.203: v1(100.06,4.54) 101.48,5.96 v1(101.48,16.27) ; v1(134.27,16.27) 134.27,48.4 U1.64
15.7: length 83.9
  Top Layer w0.203: v1(100.79,16.86) 133.08,16.86 v1(133.13,16.91) ; v1(99.24,3.52) 94.17,3.52 P16.3
  Bottom Layer w0.203: v1(133.13,16.91) 133.13,46.96 132.97,47.11 U1.65 133.18,46.95 ; v1(99.24,3.52) 99.24,5.07 101,6.82 101,14.8 100.79,15 v1(100.79,16.86)
15.8: length 48.9
  Top Layer w0.203: P10.6 132.72,3.3 132.72,7.03 v1(131.71,8.04)
  Bottom Layer w0.203: 131.71,8.02 v1(131.71,8.04) 131.71,48.38 U1.66
20.0: length 78.8
  Top Layer w0.203: v1(116.19,1.06) 115.76,0.64 80.87,0.64 79.91,1.6 P14.3 ; U1.44 138.87,14.9 116.64,14.9
  Bottom Layer w0.203: v1(116.64,15) 116.64,7.82 116.19,7.36 v1(116.19,1.06)
20.3: length 80.3
  Top Layer w0.203: U1.46 137.04,15.61 115.73,15.61 ; P14.4 81.01,6.12 81.01,4.7 84.72,0.99 114.9,0.99 v1(115.37,1.47)
  Bottom Layer w0.203: v1(115.37,1.47) 115.37,7.08 116.29,7.99 116.29,13.71 115.73,14.27 v1(115.73,15.66)
20.6: length 15.4
  Top Layer w0.203: v1(140.57,28.24) 145.01,28.24 145.84,27.41 R42.2
  Bottom Layer w0.203: U1.49 140.52,36.87 140.52,28.29 v1(140.57,28.24)
20.7: length 20.2
  Top Layer w0.203: v1(143.21,26.54) 144.83,26.54 146.77,24.6 147.86,24.6 148.29,24.17 148.29,23.13 147.15,21.99 147.15,21.5 R43.2
  Bottom Layer w0.203: v1(143.21,26.54) 143.31,26.64 143.31,36.82 U1.50
20.10: length 65.4
  Top Layer w0.203: v1(111.46,17.8) 137.01,17.8 v1(137.09,17.87)
  Bottom Layer w0.203: 111.49,3.74 111.47,3.76 111.47,17.79 v1(111.46,17.8) ; U1.53 137.09,38.52 v1(137.09,17.87)
20.11: length 28.3
  Top Layer w0.203: v1(145.57,52.95) 134.1,52.95 P4.3
  Bottom Layer w0.203: v1(145.57,52.95) 145.57,44.47 U1.54
20.12: length 13.9
  Bottom Layer w0.203: P4.5 139.35,52.78 139.35,45.86 U1.55
20.13: length 13.9
  Bottom Layer w0.203: P4.6 141.94,52.73 141.94,45.81 U1.56
20.14: length 19.8
  Top Layer w0.203: P4.4 135.91,53.69 v1(144.63,53.69)
  Bottom Layer w0.203: v1(144.63,53.69) 144.63,48.61 U1.57
21.2: length 130
  Top Layer w0.203: v1(76.87,15.94) 77.98,14.83 91.17,14.83 92.88,13.11 98.39,13.11 98.73,13.45 138.31,13.45 139.86,11.9 139.94,11.9 140.27,11.57 U1.38 ; R19.1 47.95,52.28 48.09,52.14 48.09,49.73 51.04,46.77 v1(76.81,46.77)
  Bottom Layer w0.203: v1(76.87,15.94) 76.81,16 v1(76.81,46.77)
21.3: length 132.4
  Top Layer w0.203: v1(76.16,15.16) 76.84,14.47 90.91,14.47 92.63,12.76 98.75,12.76 99.02,13.02 138.21,13.02 139.12,12.11 139.12,11.27 140.24,10.15 142.04,10.15 U1.39 ; R20.2 47.19,50.01 51.21,45.99 v1(76.2,45.99)
  Bottom Layer w0.203: v1(76.2,45.99) 76.16,45.95 v1(76.16,15.16)
21.4: length 133.6
  Top Layer w0.203: v1(77.53,47.57) 50.75,47.57 48.52,49.8 48.52,53.43 48,53.95 R21.1 ; U1.40 142.14,12.59 139.88,12.59 138.64,13.84 99.45,13.84 98.08,15.21 79.18,15.21 v1(77.68,16.71)
  Bottom Layer w0.203: v1(77.53,47.57) 77.68,47.41 v1(77.68,16.71)
21.5: length 135.1
  Top Layer w0.203: v1(78.39,17.57) 80.4,15.56 98.3,15.56 99.62,14.24 138.77,14.24 140.04,12.97 142.02,12.97 U1.41 ; R22.2 48.6,55.46 48.88,55.19 48.88,49.94 50.62,48.2 78.26,48.2 v1(78.34,48.28)
  Bottom Layer w0.203: v1(78.34,48.28) 78.35,48.26 78.35,17.61 v1(78.39,17.57)
22.0: length 7.5
  Top Layer w0.203: U1.34 134.27,10.3 134.27,7.49 133.82,7.03 P10.5
22.1: length 4.6
  Top Layer w0.203: U1.35 138.08,5.56 P10.1
22.2: length 11
  Top Layer w0.203: U1.36 137.01,10.51 137.01,7.28 135.21,5.48 135.21,3.52 136.36,2.38 P10.4
22.3: length 10.4
  Top Layer w0.203: U1.37 140.62,3.65 140.26,3.29 137.81,3.29 P10.3
23.1: length 15
  Top Layer w0.203: P10.10 130.06,0.88 134.68,0.88 134.85,1.06 134.85,5.78 135.54,6.47 U1.33
33.4: length 20.9
  Top Layer w0.203: P15.3 107.99,5.33 116.85,5.33 119.36,7.84 121.04,7.84 121.62,8.43 121.62,10.25 U1.22
33.5: length 16.1
  Top Layer w0.203: U1.23 121.29,7.49 119.51,7.49 116.95,4.92 110.12,4.92 P15.4
33.6: length 101.1
  Top Layer w0.203: P11.3 64.41,53.43 62.26,53.43 61.08,52.25 R46.1 ; v1(74.22,22.06) 74.66,22.06 75.42,22.83 90.96,22.83 93.58,20.21 98.63,20.21 99.4,19.45 v1(122.74,19.45)
  Bottom Layer w0.203: P11.3 66.73,53.17 66.73,51.33 74.25,43.81 74.25,22.09 v1(74.22,22.06) ; U1.24 122.74,11.68 v1(122.74,19.45)
33.7: length 102.3
  Top Layer w0.203: v1(123.96,20.08) 99.34,20.08 98.76,20.67 93.81,20.67 91.24,23.23 74.22,23.23 v1(73.69,23.77) ; R47.2 60.06,50.65 62.34,52.93 64.43,52.93 P11.4
  Bottom Layer w0.203: v1(73.69,23.77) 73.69,43.67 P11.4 ; v1(123.96,20.08) 123.96,10.46 U1.25
33.9: length 147.7
  Top Layer w0.203: v1(124.75,20.79) 100.41,20.79 98.28,22.93 93.05,22.93 92.06,23.92 79.25,23.92 v1(79.23,23.89) ; R8.1 34.86,49.7 36.48,51.33 v1(36.48,57.32)
  Bottom Layer w0.203: v1(124.75,20.79) 124.75,18.13 126.5,16.38 126.5,10.46 U1.27 ; v1(79.23,23.89) 79.23,49.42 78.14,50.51 75.8,50.51 75.11,51.2 75.11,55.67 73.44,57.35 36.51,57.35 v1(36.48,57.32)
33.10: length 31.6
  Top Layer w0.203: v1(127.72,28.95) 116.57,28.95 R30.1 R31.1
  Bottom Layer w0.203: v1(127.72,28.95) 129.37,27.3 129.37,13.02 U1.28
33.11: length 37.8
  Top Layer w0.203: R40.2 146.82,29.08 v1(129.85,29.08)
  Bottom Layer w0.203: U1.29 129.22,10.28 129.22,11.98 129.85,12.62 v1(129.85,29.08)
33.12: length 46.4
  Top Layer w0.203: v1(130.54,34.46) 135.26,34.46 139.96,29.76 v1(145.88,29.76) ; v1(150.93,29.79) 150.93,29.7 151.62,29.01 R41.2
  Bottom Layer w0.203: v1(145.88,29.76) 150.91,29.76 v1(150.93,29.79) ; U1.30 130.54,11.65 130.5,11.69 130.5,34.42 v1(130.54,34.46)
A0: length 94.5
  Top Layer w0.203: 32.51,14.81 32.51,11.96 35.26,9.21 87.36,9.21 90.73,5.83 116.85,5.83 120.05,9.03 U1.21
A1: length 87
  Top Layer w0.203: OPA_MOD1.10 45.3,9.64 87.51,9.64 90.96,6.19 116.52,6.19 119.18,8.86 119.18,10.15 U1.20
A2: length 80.2
  Top Layer w0.203: U1.19 117.76,7.97 116.34,6.55 91.27,6.55 87.81,10 47.48,10 OPA_MOD1.11
A3: length 79.6
  Top Layer w0.203: OPA_MOD1.12 49.67,10.36 88.09,10.36 91.55,6.9 115.93,6.9 116.64,7.61 116.64,10.15 U1.18
A4: length 67.7
  Top Layer w0.203: OPA_MOD2.7 52.71,12.54 54.46,10.79 88.17,10.79 91.7,7.26 113.44,7.26 U1.17
A5: length 61.8
  Top Layer w0.203: OPA_MOD2.10 60.33,12.77 61.96,11.14 88.35,11.14 91.85,7.64 113.21,7.64 113.93,8.35 113.93,10.33 U1.16
A11: length 103.2
  Top Layer w0.203: 22.18,4.53 22.15,4.56 v1(22.15,5.81) ; R28.1 R27.2 20.66,4.4 C27.1
  Bottom Layer w0.203: U1.11 105.14,6.57 105.14,1.72 104.27,0.86 37.8,0.86 36.53,2.13 36.53,7.08 35.21,8.4 30.94,8.4 28.35,5.81 v1(22.15,5.81)
A16: length 47.6
  Top Layer w0.203: U1.8 103.82,10.28 103.82,8.45 103.36,7.99 92,7.99 88.5,11.5 66.18,11.5 OPA_MOD2.11
A17: length 39.6
  Top Layer w0.203: U1.7 101.35,10.2 90.66,10.2 89.01,11.85 68.21,11.85 65.41,14.65 OPA_MOD2.12
NETB1_1: length 8.3
  Top Layer w0.203: R29.2 122.12,25.8 B1.1
NETB1_2: length 8.5
  Top Layer w0.203: Q2.3 118.6,33.11 119.01,32.7 B1.2
NETC4_1: length 10.1
  Top Layer w0.75: 18.7,38.75 18.7,39.49 18.2,39.99 C4.1 16.66,41.13 17.76,42.23 19,42.23 19.44,42.67 L2.1
NETC4_2: length 2.7
  Top Layer w0.75: 13.29,38.8 13.29,39.55 13.73,39.99 C4.2
NETC7_2: length 1.6
  Top Layer w1.016: C7.2 R7.1
NETC11_2: length 3.7
  Top Layer w0.635: C11.2 13.63,17.2 14.38,16.46 U3.1
NETC14_2: length 1.6
  Top Layer w0.508: C14.2 R14.1
NETLED3V3_A: length 1.5
  Top Layer w0.508: LED3V3.A 71.43,44.48 71.43,43.05 R16.2
NETLED5V_A: length 4.8
  Top Layer w0.75: LED5V.A R13.1
NETLEDCAM_A: length 3
  Top Layer w0.203: R17.2 49.66,44.08 LEDCAM.A
  Top Layer w0.508: 49.66,44.12 LEDCAM.A
NETLEDOP_A: length 1.6
  Top Layer w0.508: R18.2 49.82,15.37 49.82,13.86 LEDOP.A
NETLEDSTEER_A: length 1.5
  Top Layer w0.635: LEDSteer.A 25.08,51.14 25.08,49.74 R6.1
NETOPA_MOD1_1: length 4.4
  Bottom Layer w0.254: OPA_MOD1.1 45.23,40.22 45.23,44.63 P7.6
NETOPA_MOD1_3: length 4.4
  Bottom Layer w0.254: OPA_MOD1.3 40.15,40.22 40.15,44.63 P7.4
NETOPA_MOD1_4: length 4.4
  Bottom Layer w0.254: P7.3 37.61,44.63 37.61,40.22 OPA_MOD1.4
NETOPA_MOD1_6: length 4.4
  Bottom Layer w0.254: P7.1 32.53,44.63 32.53,40.22 32.51,40.21
NETOPA_MOD2_1: length 4.4
  Bottom Layer w0.254: 65.4,40.21 65.41,40.22 65.41,44.63 P8.6
NETOPA_MOD2_3: length 4.4
  Bottom Layer w0.254: 60.32,40.21 60.33,40.22 60.33,44.63 P8.4
NETOPA_MOD2_4: length 4.4
  Bottom Layer w0.254: 57.78,40.21 57.79,40.22 57.79,44.63 P8.3
NETOPA_MOD2_6: length 4.4
  Bottom Layer w0.254: P8.1 52.71,44.63 52.71,40.22 52.7,40.21
NETP1_1: length 7.6
  Top Layer w0.254: P1.1 27.21,53.63 27.93,52.92 R8.2
NETP5_1: length 2.8
  Top Layer w0.254: P5.1 43.33,54.46 43.84,53.95 R21.2
NETP5_2: length 2.7
  Top Layer w0.254: P5.2 43.33,51.92 43.69,52.28 R19.2
NETP5_5: length 8.7
  Top Layer w0.254: R22.1 45.02,55.46 44.28,56.2 39.66,56.2 P5.5
NETP5_6: length 8.2
  Top Layer w0.254: P5.6 39.18,50.65 R20.1
NETP6_1: length 8.2
  Top Layer w0.254: R25.2 39.28,3.32 P6.1
NETP6_2: length 8.4
  Top Layer w0.254: R23.2 44.4,6.64 43.8,6.04 39.1,6.04 P6.2
NETP6_5: length 2.7
  Top Layer w0.254: R26.1 44.7,4.98 44.4,4.68 P6.5
NETP6_6: length 3
  Top Layer w0.254: P6.6 44.08,8.31 R24.1
NETP17_3: length 58.4
  Top Layer w0.203: P17.3 91.53,3.4 90.02,3.4 89.11,4.31 89.11,4.93 v1(87.34,6.7) ; R33.2 R32.1 98.89,18.79 97.97,17.87 90.2,17.87 v1(90.18,17.85)
  Bottom Layer w0.203: v1(87.34,6.7) 87.34,8.43 90.18,11.27 v1(90.18,17.85)
NETP18_1: length 2.6
  Top Layer w0.254: P18.1 57.25,54.46 57.53,54.18 57.58,54.18 57.85,53.91 R48.2
NETP18_2: length 2.5
  Top Layer w0.254: P18.2 55.54,51.93 57.58,51.93 57.85,52.2 R46.2
NETP18_5: length 8.4
  Top Layer w0.254: R49.1 57.85,55.51 57.58,55.78 56.92,55.78 56.57,56.13 52.11,56.13 P18.5
NETP18_6: length 7.9
  Top Layer w0.254: R47.1 51.71,50.65 P18.6
NETP19_1: length 7.9
  Top Layer w0.254: R52.2 51.59,3.53 P19.1
NETP19_2: length 8.3
  Top Layer w0.254: P19.2 51.78,5.89 56.19,5.89 56.99,6.69 R50.2
NETP19_5: length 2.6
  Top Layer w0.254: P19.5 55.86,4.68 56.38,5.2 57.76,5.2 R53.1
NETP19_6: length 2.8
  Top Layer w0.254: P19.6 56.58,8.27 R51.1
NETQ2_1: length 1.8
  Top Layer w0.203: Q2.1 114.87,30.66 R30.2
NETR2_2: length 1.7
  Top Layer w1.016: R2.2 13.4,34.48 U2.4
NETR3_1: length 6.5
  Top Layer w1.016: R3.1 16.31,43.25 R4.2 R4.ADJ
NETR4_1: length 21.3
  Top Layer w0.635: U2.5 v1(19.96,34.6) ; v1(17.76,48.34) 17.75,48.33 R4.1 13.11,48.63
  Bottom Layer w0.635: 17.78,48.31 17.78,42.22 19.96,40.04 v1(19.96,34.6)
NETR7_2: length 5.8
  Top Layer w1.016: R7.2 20.44,32.98 21.04,33.58 21.04,35.27 20.44,35.87 U2.6
NETR9_2: length 3
  Top Layer w0.508: U3.4 19.44,15.98 20.92,14.5 21.14,14.5 R9.2
NETR10_1: length 1.7
  Top Layer w0.508: R11.2 R10.1
NETR11_1: length 9.1
  Top Layer w0.508: R12.2 R11.1 23.25,17.67 v1(23.91,17.67) ; U3.5 19.44,21.92 19.51,21.99 19.59,21.91 v1(20.21,21.91)
  Bottom Layer w0.508: v1(20.21,21.91) 23.91,18.21 v1(23.91,17.67)
NETR14_2: length 5.4
  Top Layer w0.508: R14.2 21.19,22.59 21.19,23.31 20.99,23.51 18.46,23.51 18.17,23.22 U3.6
NETR34_2: length 4.7
  Top Layer w0.203: S2.1 148.03,32.26 148.45,31.84 R40.1
NETR35_2: length 4.8
  Top Layer w0.203: S2.2 150.57,31.91 150.02,31.36 R41.1
NETR36_2: length 7.9
  Top Layer w0.203: R42.1 149.99,27.41 R36.2 150.02,26.69 150.27,26.43 150.78,26.43 150.9,26.31 150.9,25.79 S3.2 S3.2
NETR37_2: length 8.2
  Top Layer w0.203: 150.93,19.89 151.03,19.89 ; 150.93,19.89 150.93,20.27 150.81,20.39 150.15,20.39 150.02,20.51 R37.2 R43.1 ; 150.93,19.89 150.83,19.89 151.02,19.7 151.03,19.7 S4.2 S4.2
NETR38_2: length 8.1
  Top Layer w0.203: 150.93,13.74 150.93,14.37 150.81,14.49 150.15,14.49 150.02,14.61 R38.2 R44.1 ; 150.93,13.74 150.93,13.61 S5.2 ; 150.93,13.74 146.98,13.74
NETR39_2: length 9.5
  Top Layer w0.203: R39.2 150.02,8.44 150.15,8.32 150.81,8.32 150.93,8.2 150.93,7.61 150.98,7.57 146.98,7.57 ; R39.2 R45.1 R39.2

## Copper pours and planes (outline as drawn; the poured copper is in the pictures)
GND on Top Layer: 0,2.28 0.73,0.64 2.42,0 2.42,0 151.38,0 151.43,0.01 151.47,0.03 152.84,0.81 153.42,2.28 153.42,56.26 153.42,56.33 152.75,57.96 151.13,58.68 2.28,58.68 0.64,57.94 0,56.26 0,56.24 0,2.31
GND on Bottom Layer: 0,2.28 0.73,0.64 2.42,0 2.42,0 151.38,0 151.43,0.01 151.47,0.03 152.84,0.81 153.42,2.28 153.42,56.26 153.42,56.33 152.75,57.96 151.13,58.68 2.28,58.68 0.64,57.94 0,56.26 0,56.24 0,2.31
VCCBAT on Top Layer: 9.1,38.22 9.1,35.15 9.48,34.76 11.56,34.76 12.02,35.22 14.2,35.22 14.36,35.37 14.36,37.58 14.15,37.79 12.22,37.79 11.51,38.5 9.38,38.5
VCCBAT on Top Layer: 5.01,58.56 5.01,45.66 8.54,42.13 8.54,35.25 9,34.79 11.59,34.79 12.02,35.22 12.02,37.99 11.51,38.5 9.38,38.5 9.38,42.84 10.27,43.73 10.27,57.8 9.51,58.56
VCCBAT on Top Layer: 4.81,26.64 4.81,20.44 5.29,19.96 8.11,19.96 8.49,19.58 8.49,6.72 10.85,4.36 10.85,1.85 11.69,1.01 17.02,1.01 17.41,1.39 17.41,3.22 17.81,3.62 19.64,3.62 19.84,3.83 19.84,5.4 19.49,5.76 14.79,5.76 12.2,8.35 12.2,26.64 11.77,27.07 5.34,27.07
VCCBAT on Bottom Layer: 5.19,58.26 5.19,45.56 6.46,44.29 6.46,28.16 4.93,26.64 4.93,20.34 5.39,19.88 11.74,19.88 12.17,20.31 12.17,27.6 10.62,29.15 10.62,29.18 9.89,29.91 9.89,58.07 9.56,58.4
VCCSTEER on Top Layer: 15.8,46.83 15.8,44.9 16.24,44.47 17.53,44.47 17.81,44.75 17.81,46.68 18.17,47.03 22.43,47.03 22.64,46.83 22.64,38.47 23.25,37.86 26.75,37.86 27.44,38.55 27.44,46.96 26.32,48.07 24.92,48.07 24.26,48.73 24.26,50.16 23.93,50.49 22.99,50.49 22.74,50.74 22.74,54.5 21.98,55.26 20.53,55.26 20.02,54.75 20.02,48.56 19.13,47.67 16.64,47.67
NETC8_1 on Top Layer: 16.34,17.42 16.34,15.21 15.55,14.42 12.93,14.42 12.5,13.99 12.5,9.24 14.36,7.38 19.74,7.38 20.1,7.74 20.1,10.56 19.21,11.45 18.52,11.45 17.89,12.08 17.89,14.65 18.7,15.46 18.7,17.39 18.37,17.72 16.64,17.72
NETC11_1 on Top Layer: 13.06,30.42 12.38,29.74 12.38,20.21 13.16,19.42 14.43,19.42 15.68,20.67 16.14,20.67 16.29,20.82 16.29,29.84 15.7,30.42
NETC12_2 on Top Layer: 17.33,31.01 17.33,25.09 18.24,24.17 26.45,24.17 28.45,22.17 30.41,22.17 30.61,22.37 30.61,25.62 30.11,26.13 25.46,26.13 24.34,27.25 24.34,31.77 23.83,32.02 18.34,32.02
NETD1_A on Top Layer: 0.79,40.38 0.79,37.36 1.78,36.37 5.82,36.37 6.43,35.76 6.43,32.3 7.96,30.78 11.26,30.78 11.51,31.03 11.49,31.06 11.49,32.15 11,32.63 8.77,32.63 8.34,33.06 8.34,40.68 7.63,41.39 1.66,41.39
NETD1_K on Top Layer: 1.96,30.4 1.96,27.78 2.42,27.32 2.83,27.32 3.23,26.92 3.23,22.52 2.98,22.27 0.79,22.27 0.49,21.96 0.49,14.57 0.97,14.09 7.3,14.09 7.55,14.34 7.55,18.81 6.74,19.63 4.86,19.63 4.55,19.93 4.55,27.02 4.96,27.42 9.63,27.42 9.81,27.6 9.81,30.07 9.2,30.68 2.22,30.68
NETQ1_2 on Top Layer: 1.1,35.65 5.82,35.65 6.18,35.3 6.18,32.17 5.62,31.62 2.27,31.62 1.73,31.08 1.73,27.73 3.03,26.43 3.03,25.16 2.75,24.88 0.79,24.88 0.39,25.29 0.39,34.99 1.07,35.68

Small or netless copper shapes (teardrops, artwork), in the pictures only: 423 on Top Layer, 165 on Bottom Layer

## Text on the board
Top Layer: 南京航空航天大学 / 智控天巡 / 2025年
Top Silkscreen Layer: 11 | 14 | 13 | 11.3 | 11.2 | 20.6 | 20.7 | 10.6 | G | 5V | 10.5 | 11.6 | 10.2 | NC | A0 | GND | 06.4 | 02.4 | A1 | A2 | 02.7 | 02.5 | A3 | 02.6 | 10.1 | 02.0 | 02.1 | 02.3 | 02.2 | 3V3 | A4 | 10.3 | A5 | A16 | 00.7 | 00.6 | 00.5 | 00.4 | 00.3 | 00.2 | 00.1 | 00.0 | A17 | 20.0 | 20.3 | 15.7 | 00.8 | 15.6 | RX | TX | 33.4 | 33.5 | 20.10 | 20. | 23. | 1 | 16. | 22. | 8 | 0 | 2 | 3 | 11.9 | 11.10 | 11.11 | 15.3 | 11.12 | 15.5 | 13.0 | 15.1 | 13.1 | 15.0 | 13.2 | 15.2 | 13.3 | 15.4 | 21.3 | 21.5 | 21.2 | 21.4 | 33.6 | 33.7 | 02.8 | 00.9 | 舵机电压调节 | － | ＋ | 33.9 | 电磁 | 接口1 | 接口2 | 磁铁 | 感应 | 定位 | 模块 | 屏幕 | 接口 | ToF | 姿态传感器 | 无线 | SPI | 舵机接口 | 串口 | 有刷电机2 | 无刷电机2 | 编码器2 | 编码器4 | 有刷电机1 | 无刷电机1 | 编码器1 | 编码器3
